# EAGLE design MTRduino_Rev3.0 (EAGLE 7.2.0)
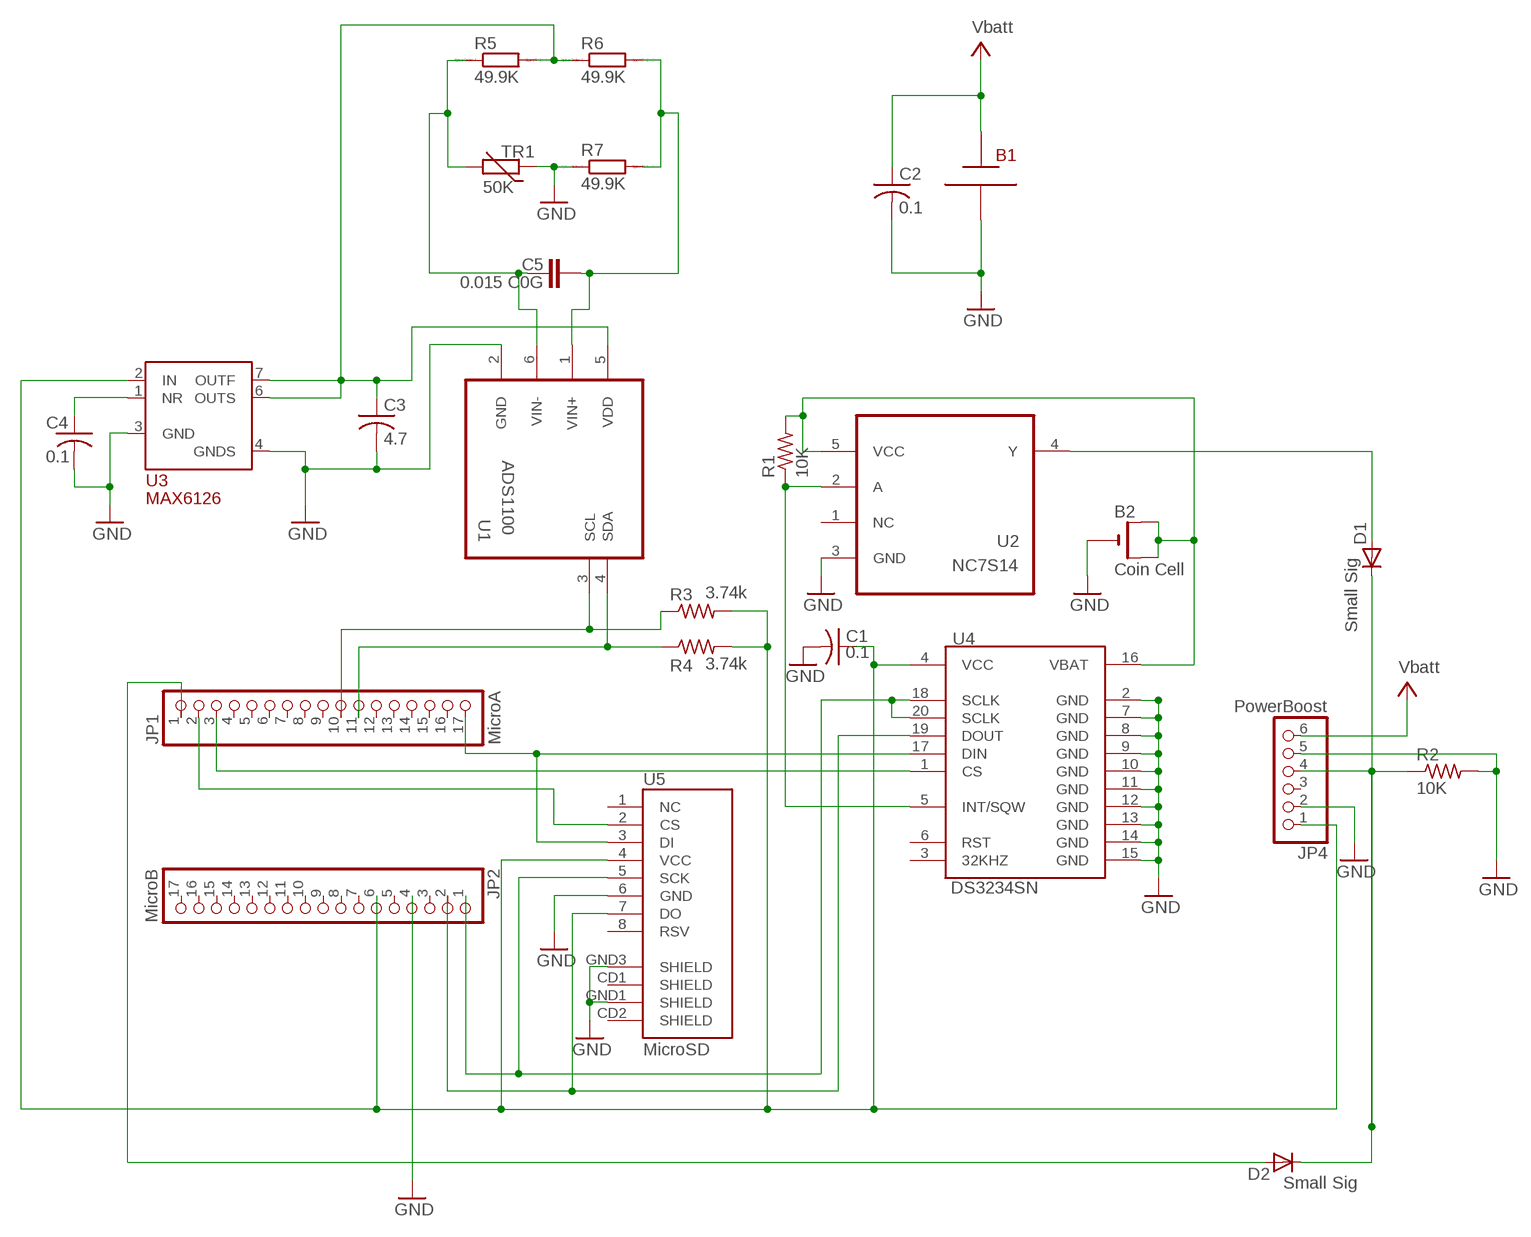
[diagram p0: schematic, sheet 1]

## Parts
B1  2x AA BATT  BATT_AA2  [BATT_AA2]
B2  Coin Cell  CR1220SMT  [CR1220-SMD]
C1  0.1  C-USC0603  [C0603]
C2  0.1  C-USC0603  [C0603]
C3  4.7  C-USC0603  [C0603]
C4  0.1  C-USC0603  [C0603]
C5  0.015 C0G  C-EUC0603  [C0603]
D1  Small Sig  DIODESOD-323F  [SOD-323F]
D2  Small Sig  DIODESOD-323F  [SOD-323F]
JP1  MicroA  PINHD-1X17  [1X17]
JP2  MicroB  PINHD-1X17  [1X17]
JP4  PowerBoost  PINHD-1X6  [1X06]
R1  10K  R-US_R0603  [R0603]
R2  10K  R-US_R0603  [R0603]
R3  3.74k  R-US_R0603  [R0603]
R4  3.74k  R-US_R0603  [R0603]
R5  49.9K  RR3216  [R3216]
R6  49.9K  RR3216  [R3216]
R7  49.9K  RR3216  [R3216]
TR1  50K  THERMISTOR_R-5  [R-5]
U1  ADS1100  ADS1100A0IDBVT  [SOT95P280X145-6N]
U2  NC7S14  1P1G14MDBVREPG4  [SOT95P280X145-5N]
U3  MAX6126  [SOIC127P600X175-8N]
U4  DS3234SN  DS3234  [DS3234]
U5  MicroSD  USD-SOCKETNEW  [MICRO-SD-SOCKET-PP]

## Nets
GND: B1.- B2.- C1.2 C2.2 C3.2 C4.2 JP2.4 JP4.2 JP4.5 R2.2 R7.1 TR1.1 U1.2(GND) U2.3(GND) U3.3(GND) U3.4(GNDS) U4.2(GND) U4.7(GND) U4.8(GND) U4.9(GND) U4.10(GND) U4.11(GND) U4.12(GND) U4.13(GND) U4.14(GND) U4.15(GND) U5.6(GND) U5.GND1(SHIELD) U5.GND3(SHIELD)
N$1: D1.A U2.4(Y)
N$2: C5.1 R5.1 TR1.2 U1.6(VIN-)
N$3: JP1.3 U4.1(CS)
N$4: C4.1 U3.1(NR)
N$5: C5.2 R6.2 R7.2 U1.1(VIN+)
N$6: B2.+$1(+) B2.+$2(+1) R1.2 U2.5(VCC) U4.16(VBAT)
N$8: JP1.17 U4.17(DIN) U5.3(DI)
N$9: JP1.10 R3.1 U1.3(SCL)
N$10: JP1.11 R4.1 U1.4(SDA)
N$14: C3.1 R5.2 R6.1 U1.5(VDD) U3.6(OUTS) U3.7(OUTF)
N$17: R1.1 U2.2(A) U4.5(INT/SQW)
N$18: JP2.2 U4.19(DOUT) U5.7(DO)
N$21: D2.A JP1.1
N$31: D1.C D2.C JP4.4 R2.1
N$37: JP2.1 U4.18(SCLK) U4.20(SCLK) U5.5(SCK)
N$40: C1.1 JP2.6 JP4.1 R3.2 R4.2 U3.2(IN) U4.4(VCC) U5.4(VCC)
N$41: JP1.2 U5.2(CS)
V+: B1.+ C2.1 JP4.6 ; supply symbol labelled Vbatt
Unconnected: JP1.4 JP1.5 JP1.6 JP1.7 JP1.8 JP1.9 JP1.12 JP1.13 JP1.14 JP1.15 JP1.16 JP2.3 JP2.5 JP2.7 JP2.8 JP2.9 JP2.10 JP2.11 JP2.12 JP2.13 JP2.14 JP2.15 JP2.16 JP2.17 JP4.3 U2.1(NC) U4.3(32KHZ) U4.6(RST) U5.1(NC) U5.8(RSV) U5.CD1(SHIELD) U5.CD2(SHIELD)

## Library data of the parts
B1 = adafruit:BATT_AA2
B2 = adafruit:CR1220: CR1216/CR1220/CR1225 12mm 3V lithium coin cell Great for battery packup. Both SMT and THM holders. Note the THM package has the ground pads on both sides of the PCB so that the masks are the same - this reduces the cost
C1-C4 = adafruit:C-US: CAPACITOR, American symbol
C5 = resistor:C-EU: CAPACITOR, European symbol
D1 D2 = adafruit:DIODE: Diode SMADIODE - SMA Surface Mount Package 20V 1A Schottky Diode Digikey: 641-1014-6-ND DO-1N4148 - Through Hole Small Current Diode SOD-123 20V 1 A (.5mV Vf) Schottky Diode - Digikey: MBRX120TPMSCT-ND SOD-323 10V 570mA (.38mV Vf, 3ns) Schottky Diode - Digikey: ZLLS410CT-ND SOD-523 30V 30mA Schottky Diode (RB751S-40TE61) - Digikey: RB751S-40TE61CT-ND SOT23-R/W - SOT23 Package (R = Solder Paste/Reflow Ovens, W = Hand-Soldering) BAT54Film 40V 300mA - Digikey: 497-7162-1-ND
JP1 JP2 = pinhead:PINHD-1X17: PIN HEADER
JP4 = pinhead:PINHD-1X6: PIN HEADER
R1-R4 = resistor:R-US_: RESISTOR, American symbol
R5-R7 = eagle-ltspice:R: RESISTOR, European symbol; SPICEMODEL: NONE; SPICEPREFIX: R
TR1 = discrete:THERMISTOR_: Thermo Resistor
U1 = Texas Instruments_By_element14_Batch_1:ADS1100A0IDBVT: Self-Calibrating, 16-Bit ANALOG-TO-DIGITAL CONVERTER; MPN: ADS1100A0IDBVT; OC_FARNELL: 1135959; OC_NEWARK: 20H0708; PACKAGE: SOT-23-6; SUPPLIER: Texas Instruments
U2 = Texas Instruments_By_element14_Batch_1:1P1G14MDBVREPG4: SINGLE SCHMITT-TRIGGER INVERTER; MPN: 1P1G14MDBVREPG4; OC_FARNELL: -; OC_NEWARK: 56P2415; PACKAGE: SOT-23-5; SUPPLIER: Texas Instruments
U3 = Maxim_By_element14_Batch_1:MAX6126
U4 = SparkFun-FreqCtrl:DS3234: SPI RTC module with battery backup and internal clock.
U5 = SparkFun-Connectors:USD-SOCKET: microSD Socket Push-push type uSD socket. Schematic element and footprint production proven. Spark Fun Electronics SKU : PRT-00127. tDoc lines correctly indicate media card edge positions when inserting (unlocked, locked, depressed).

## Board
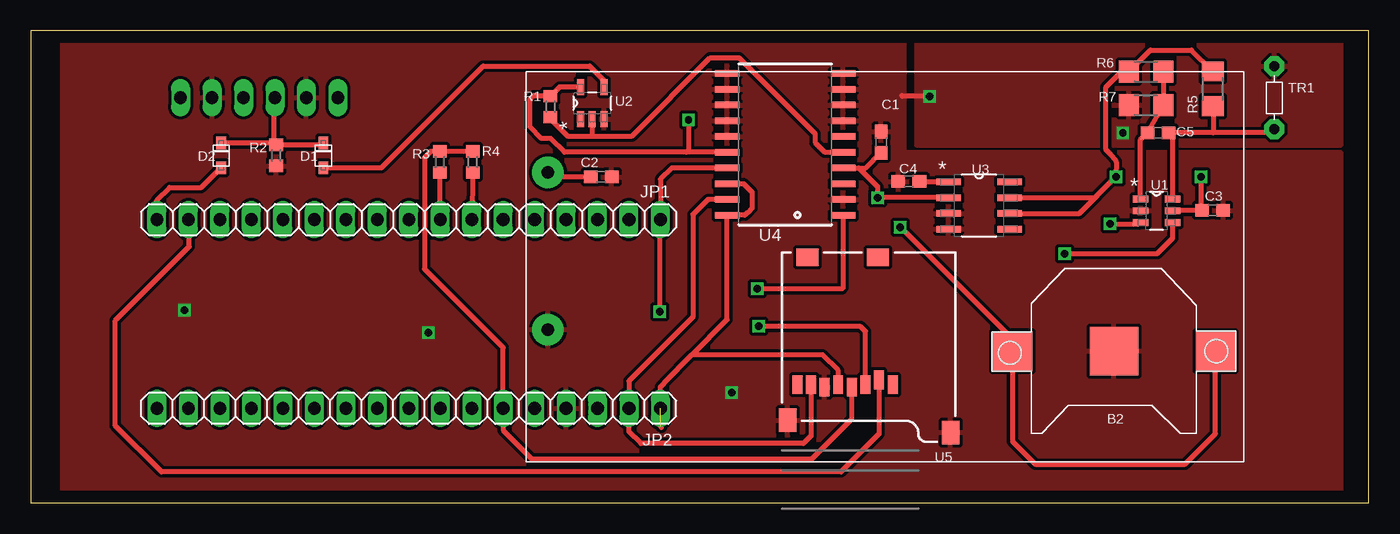
[diagram p1: board, top side]
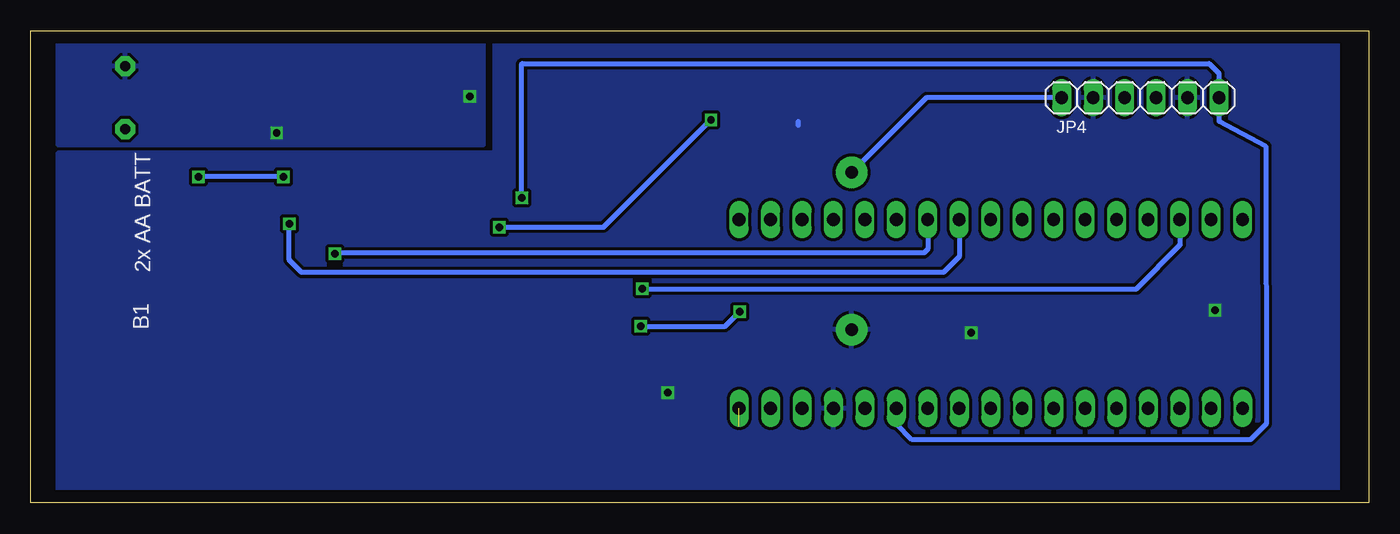
[diagram p2: board, bottom side, seen from below]

Size 107.94 x 38.09 mm. Coordinates in mm from the lower left corner, seen from the top.
Outline: 0,0 107.94,0 107.94,38.09 0,38.09 0,0
Copper layers (1*16): Top 0.035mm / dielectric 1.5mm / Bottom 0.035mm
Design rules "default *": minimum track width 10mil, minimum drill 20mil, track to track 8mil, track to pad 8mil, pad to pad 8mil, via to via 8mil, smd to smd 8mil, copper to edge 40mil, drill to drill 8mil, minimum pad ring 10mil, minimum via ring 8mil, stop-mask expansion 4mil, vias tented up to drill 0mil, thermal gap 10mil

### Footprints (pad centres in the part's own frame; a part is rotated, then mirrored left to right if it is on the bottom)
BATT_AA2 = drill 1 pad 2.54: + -27.178,7.62; - -27.178,-5.08
CR1220-SMD = smd 3.2 x 3.2: +$1 -8.2,0; +$2 8.2,0 | smd 3.9 x 3.9: - 0,0
C0603 = smd 1.1 x 1: 1 -0.85,0; 2 0.85,0
SOD-323F = smd 1 x 0.8: A -1,0; C 1,0
1X17 = drill 1.016 long: 1 -20.32,0; 2 -17.78,0; 3 -15.24,0; 4 -12.7,0; 5 -10.16,0; 6 -7.62,0; 7 -5.08,0; 8 -2.54,0; 9 0,0; 10 2.54,0; 11 5.08,0; 12 7.62,0; 13 10.16,0; 14 12.7,0; 15 15.24,0; 16 17.78,0; 17 20.32,0
1X06 = drill 1.016 long: 1 -6.35,0; 2 -3.81,0; 3 -1.27,0; 4 1.27,0; 5 3.81,0; 6 6.35,0
R0603 = smd 1 x 1.1: 1 -0.85,0; 2 0.85,0
R3216 = smd 1.6 x 1.8: 1 -1.4,0; 2 1.4,0
R-5 = drill 0.813 pad 1.6 octagon: 1 -2.54,0; 2 2.54,0
SOT95P280X145-6N = smd 1.27 x 0.559: 1 -1.295,0.94; 2 -1.295,0; 3 -1.295,-0.94; 4 1.295,-0.94; 5 1.295,0; 6 1.295,0.94
SOT95P280X145-5N = smd 1.27 x 0.559: 1 -1.295,0.94; 2 -1.295,0; 3 -1.295,-0.94; 4 1.295,-0.94; 5 1.295,0.94
SOIC127P600X175-8N = smd 1.981 x 0.533: 1 -2.464,1.905; 2 -2.464,0.635; 3 -2.464,-0.635; 4 -2.464,-1.905; 5 2.464,-1.905; 6 2.464,-0.635; 7 2.464,0.635; 8 2.464,1.905
DS3234 = smd 0.53 x 1.98: 1 -5.715,-4.685; 2 -4.445,-4.685; 3 -3.175,-4.685; 4 -1.905,-4.685; 5 -0.635,-4.685; 6 0.635,-4.685; 7 1.905,-4.685; 8 3.175,-4.685; 9 4.445,-4.685; 10 5.715,-4.685; 11 5.715,4.685; 12 4.445,4.685; 13 3.175,4.685; 14 1.905,4.685; 15 0.635,4.685; 16 -0.635,4.685; 17 -1.905,4.685; 18 -3.175,4.685; 19 -4.445,4.685; 20 -5.715,4.685
MICRO-SD-SOCKET-PP = smd 0.8 x 1.5: 1 -8.94,10.7; 2 -7.84,10.3; 3 -6.74,10.7; 4 -5.64,10.9; 5 -4.54,10.7; 6 -3.44,10.9; 7 -2.34,10.7; 8 -1.24,10.7 | smd 1.8 x 1.4: CD1 -2.05,0.4; CD2 -7.75,0.4 | smd 1.4 x 1.9: GND1 -13.6,14.55; GND3 -0.45,13.55

### Placement (x,y rotation side)
B1  68.9,19.05 0 top
B2  87.4,12.24 180 top
C1  68.61,29.11 90 top
C2  46.01,26.3 0 top
C3  95.35,23.6 0 top
C4  70.84,25.95 180 top
C5  90.96,29.87 180 top
D1  23.6,28.04 90 top
D2  15.34,28.04 90 top
JP1  30.48,22.86 0 top
JP2  30.48,7.62 180 top
JP4  18.41,32.7 180 bottom
R1  41.92,31.98 90 top
R2  19.79,28.04 270 top
R3  32.99,27.51 90 top
R4  35.65,27.51 90 top
R5  95.38,33.43 90 top
R6  89.99,34.8 0 top
R7  89.99,32.11 0 top
TR1  100.33,32.7 270 top
U1  90.83,23.57 0 top
U2  45.29,32.26 90 top
U3  76.5,23.99 0 top
U4  60.86,28.93 90 top
U5  60.6,20.22 180 top

### Tracks (layer width: path | path; a pad name or v marks a point on that pad's centre or on a via)
GND  (via drill 0.6)
  Top 0.406: 70.26,32.87 70.31,32.82 v72.52,32.82
  Bottom 0.406: 46.04,30.8 46.04,30.48
  other vias: 12.38,15.56 32.08,13.72 88.11,29.84 56.54,8.89
  pour Top (isolate 0.254): 2.54,38.42 2.54,-0.95 105.73,-0.95 105.73,28.26 70.48,28.26 70.48,39.37
  pour Bottom (isolate 0.254): 2.54,40.32 2.54,-0.95 105.73,-0.95 105.73,28.26 70.48,28.26 70.48,40.32
  pour Bottom (isolate 0.254): 71.44,28.89 105.73,28.89 105.73,39.69 71.44,39.69
  pour Top (isolate 0.254): 71.44,39.69 71.44,28.89 105.73,28.89 105.73,39.69
N$1
  Top 0.406: D1.A 28.29,27.04 36.5,35.26 45.09,35.26 46.25,34.09 46.25,33.58 U2.4
N$2
  Top 0.406: U1.6 92.13,29.55 C5.1 95.4,29.87 | TR1.2 100.04,29.87 95.4,29.87 | R5.1 95.4,32 95.4,29.87
N$3  (via drill 0.6)
  Top 0.406: U4.1 65.54,17.36 65.46,17.27 v58.62,17.27
  Bottom 0.406: 18.75,17.27 15.19,20.83 15.19,22.81 JP1.3 | v58.62,17.27 18.75,17.27 | 18.69,17.27 18.75,17.27
N$4
  Top 0.406: U3.1 71.39,25.89 C4.1
N$5
  Top 0.406: U1.1 89.53,29.3 C5.2 R7.2 R6.2
N$6  (via drill 0.6)
  Top 0.406: U2.5 42.65,33.55 R1.2 41.88,32.87 40.56,32.87 40.26,32.56 40.26,30.35 41.2,29.41 41.94,29.41 43.05,28.3 52.88,28.3 | U4.16 52.88,28.3 | B2.+$1 95.58,12.22 95.58,5.56 93.12,3.1 81.05,3.1 79.2,4.95 B2.+$2 79.2,13.2 v70.16,22.25 | v53.06,30.91 53.06,28.47 52.88,28.3
  Bottom 0.406: v70.16,22.25 61.72,22.25 v53.06,30.91
N$8  (via drill 0.6)
  Top 0.406: U4.17 51.71,27.03 50.8,26.11 JP1.17 50.75,22.81 v50.75,15.42 | U5.3 67.34,13.83 66.95,14.22 58.75,14.22 v58.73,14.25
  Bottom 0.406: v58.73,14.25 51.92,14.25 v50.75,15.42
N$9  (via drill 0.6)
  Top 0.406: v87.1,22.5 89.41,22.5 U1.3 | R3.1 32.99,22.89 JP1.10
  Bottom 0.406: JP1.10 33.02,19.86 34.29,18.59 86.11,18.59 87.1,19.58 v87.1,22.5
N$10  (via drill 0.6)
  Top 0.406: v83.41,20.12 90.88,20.12 92.13,21.36 U1.4 | R4.1 35.6,22.9 JP1.11
  Bottom 0.406: JP1.11 35.56,20.47 35.87,20.17 83.36,20.17 v83.41,20.12
N$14  (via drill 0.6)
  Top 0.406: U1.5 92.15,23.6 C3.1 94.41,23.69 v94.41,26.31 | U3.6 84.59,23.36 v87.55,26.31 | U3.7 85.86,24.62 v87.55,26.31 | v87.55,26.31 87.58,27.53 87.02,28.22 86.74,28.5 86.74,33.55 87.99,34.8 R6.1 90.34,36.55 93.65,36.55 R5.2
  Bottom 0.406: v87.55,26.31 v94.41,26.31
N$17
  Top 0.406: 45.21,29.62 43.28,29.62 41.92,30.98 R1.1 | 45.21,29.62 48.51,29.62 54.81,35.92 57.15,35.92 63.27,29.79 63.27,29.08 64.03,28.32 65.52,28.32 U4.5 | U2.2 45.29,29.69 45.21,29.62
N$18
  Top 0.406: U4.19 54.63,24.49 53.42,23.27 53.42,14.99 48.26,9.83 JP2.2 48.26,5.74 49.23,4.78 62.33,4.78 62.94,5.39 U5.7
N$21
  Top 0.406: JP1.1 10.16,24.43 11.18,25.45 13.75,25.45 D2.A
N$31
  Top 0.406: D1.C 23.45,28.89 R2.1 19.64,29.04 | 19.64,29.04 D2.C | 19.64,29.04 19.64,32.65 JP4.4
N$37  (1 unrouted)
  Top 0.406: 50.8,6.17 50.88,6.1 50.88,6.07 | U4.18 57.51,25.76 58.19,25.07 58.19,23.77 57.86,23.44 57.84,23.44 57.61,23.22 U4.20 56.19,23.2 56.19,14.78 53.34,11.94 | JP2.1 50.8,9.35 51.13,9.68 51.13,9.73 53.31,11.91 53.34,11.94 | U5.5 65.14,10.68 63.88,11.94 53.34,11.94
N$40  (via drill 0.6)
  Top 0.406: U3.2 v68.34,24.62 68.34,25.49 66.8,27.03 U4.4 67.37,27.03 C1.1 | R3.2 R4.2 32.24,28.36 31.75,27.86 31.75,18.87 38.1,12.52 JP2.6 38.1,5.84 40.41,3.53 63.02,3.53 66.24,6.76 U5.4
  Bottom 0.406: JP2.6 38.1,6.35 36.83,5.08 9.53,5.08 8.26,6.35 8.31,28.78 12.06,30.8 JP4.1 12.06,34.67 12.85,35.46 68.3,35.46 68.34,35.42 v68.34,24.62
N$41
  Top 0.406: U5.2 68.44,5.55 65.38,2.49 10.54,2.49 6.81,6.22 6.81,14.71 12.78,20.68 12.78,22.78 JP1.2
  Bottom 0.406: 12.72,22.84 JP1.2
V+
  Top 0.406: C2.1 42.09,26.3 B1.+
  Bottom 0.406: JP4.6 35.69,32.7 B1.+

### Text on the board
tValues: MTRDuino / (Version 3.0) | 12 | 11 | 10 | 9 | 8 | 7 | 6 | 5 | 4 | 3 | 2 | RS | RX | TX | SS | GND | MOSI | 13 | 3V | AREF | A0 | A1 | A2 | A3 | A4 | A5 | NC | NC | +5V | RS | VIN | MISO | SCK | GND
bValues: 5V | GND | LB | EN | GND | BAT